# EAGLE design 601_motor (EAGLE 7.7.0)
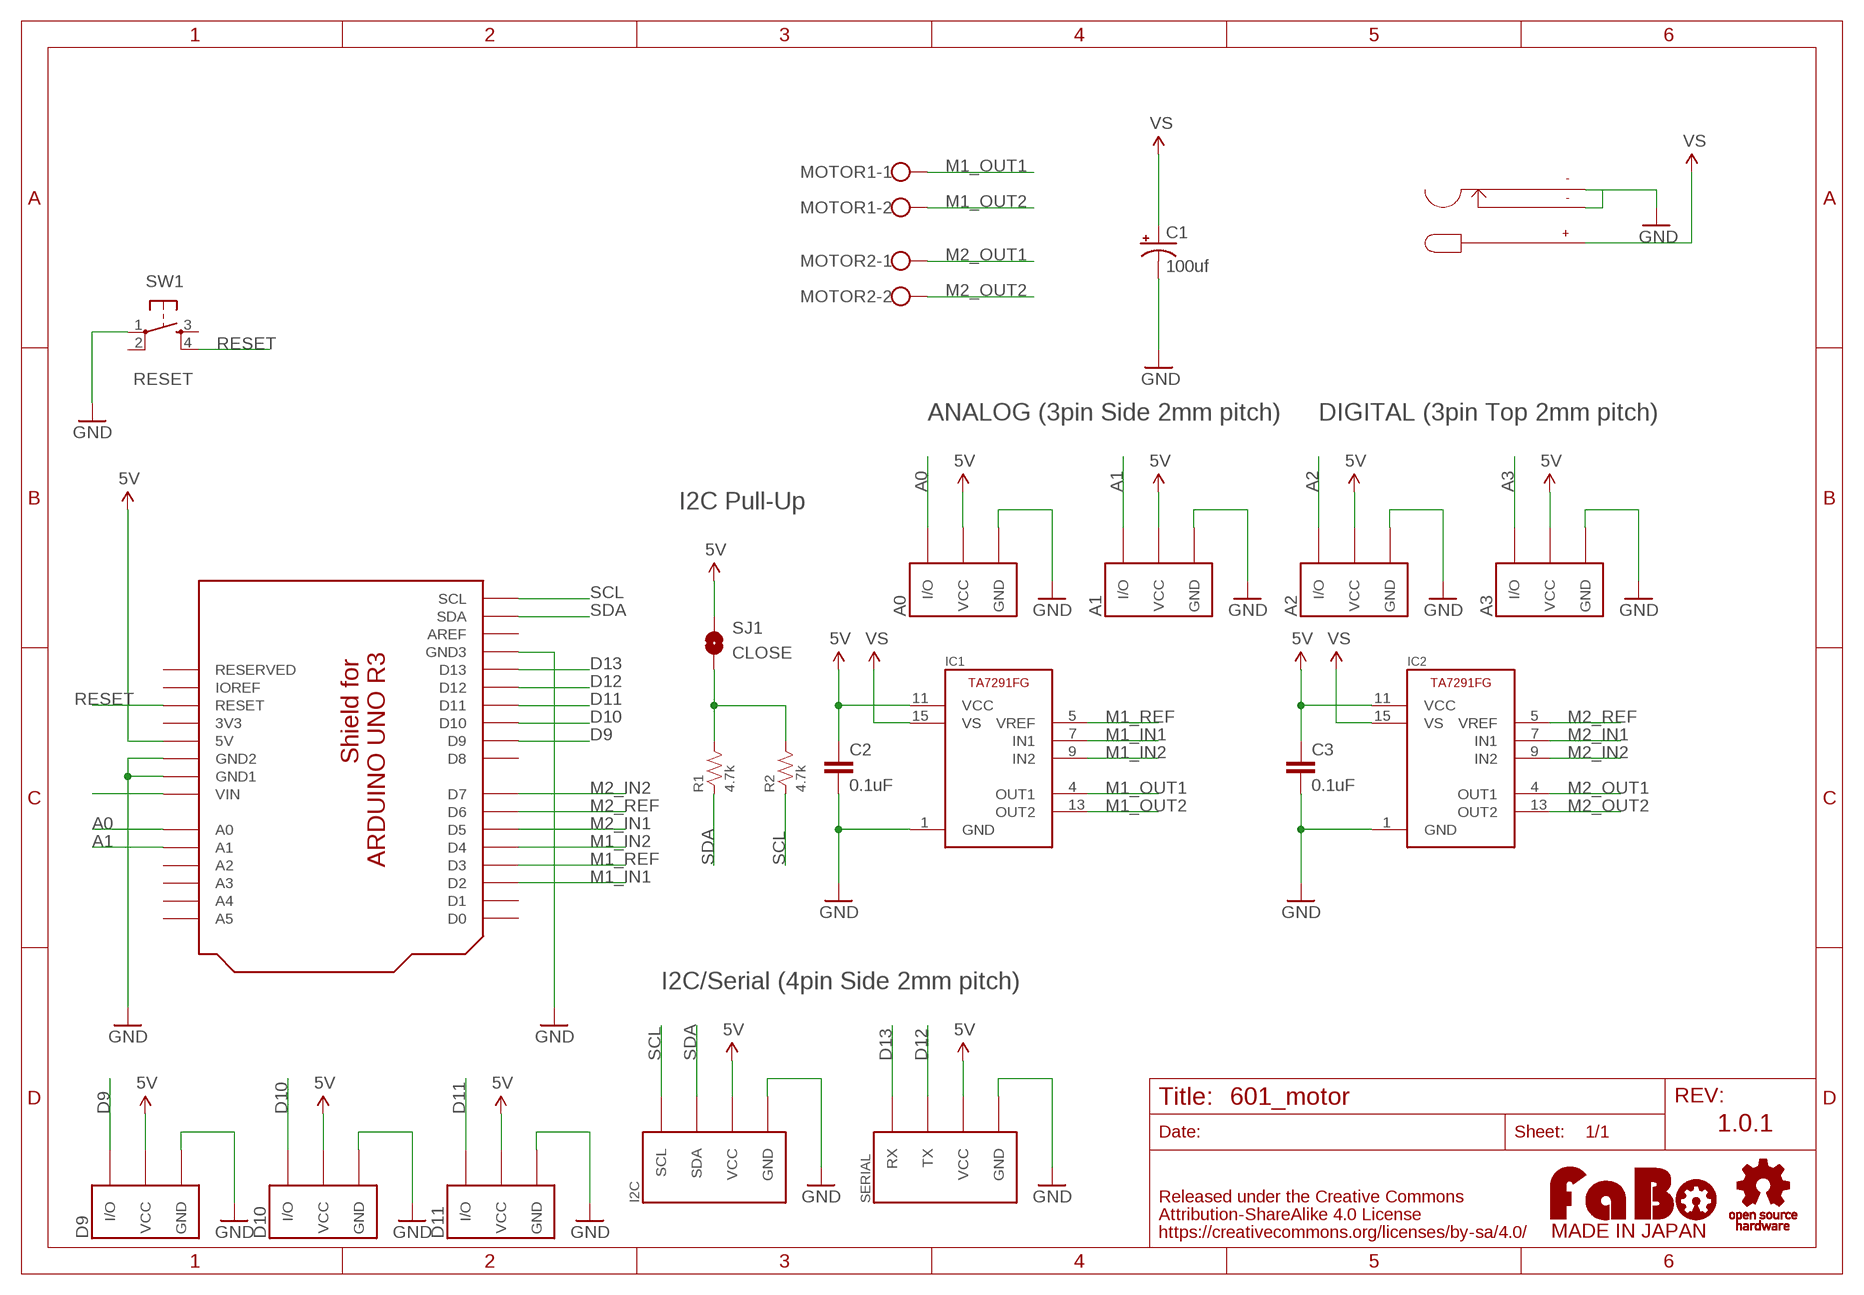
[diagram p0: schematic, sheet 1]

## Parts
A0  FABO_BRICK_3PIN-S03B-PASK-2  [FABO_BRICK_3PIN_S03B-PASK-2]
A1  FABO_BRICK_3PIN-S03B-PASK-2  [FABO_BRICK_3PIN_S03B-PASK-2]
A2  FABO_BRICK_3PIN-S03B-PASK-2  [FABO_BRICK_3PIN_S03B-PASK-2]
A3  FABO_BRICK_3PIN-S03B-PASK-2  [FABO_BRICK_3PIN_S03B-PASK-2]
C1  100uf  CPOL-US153CLV-0405  [153CLV-0405]
C2  0.1uF  CAP-EIA0603  [EIA0603]
C3  0.1uF  CAP-EIA0603  [EIA0603]
D9  FABO_BRICK_3PIN-HEADER  [FABO_BRICK_3PIN_HEADER]
D10  FABO_BRICK_3PIN-HEADER  [FABO_BRICK_3PIN_HEADER]
D11  FABO_BRICK_3PIN-HEADER  [FABO_BRICK_3PIN_HEADER]
I2C  FABO_BRICK_I2C-S04B-PASK-2  [FABO_BRICK_I2C_S04B-PASK-2]
IC1  MOTOR-DRIVER-TA7291FG  [MOTOR-DRIVER-TA7291FG]
IC2  MOTOR-DRIVER-TA7291FG  [MOTOR-DRIVER-TA7291FG]
MOTOR1  W237-102  [W237-102]
MOTOR2  W237-102  [W237-102]
R1  4.7k  RESISTOR-0603  [0603]
R2  4.7k  RESISTOR-0603  [0603]
SERIAL  FABO_BRICK_SERIAL-S04B-PASK-2  [FABO_BRICK_SERIAL_S04B-PASK-2]
SJ1  CLOSE  SMD-JUMPER-2-CLOSE  [SMD-JUMPER-2-CLOSE]
SW1  RESET  SWITCH-TACT-6MM  [DTS_6_V]
U1  ARDUINO_UNO_R3_SHIELD-NOLABEL  [ARDUINO_UNO_R3_NOLABEL]
U$2  DCJACK-MJ179PH  [MJ179PH]
U$6  LOGO_OSHW-T_M  [LOGO_OSHW_T_MS]
U$7  LOGO_FABO-M  [LOGO_FABO_MS]

## Nets
5V: A0.VCC A1.VCC A2.VCC A3.VCC C2.1 C3.1 D9.VCC D10.VCC D11.VCC I2C.VCC IC1.11(VCC) IC2.11(VCC) SERIAL.VCC SJ1.1 U1.5V
A0: A0.I/O U1.A0
A1: A1.I/O U1.A1
A2: A2.I/O
A3: A3.I/O
D9: D9.I/O U1.D9
D10: D10.I/O U1.D10
D11: D11.I/O U1.D11
D12: SERIAL.TX U1.D12
D13: SERIAL.RX U1.D13
GND: A0.GND A1.GND A2.GND A3.GND C1.- C2.2 C3.2 D9.GND D10.GND D11.GND I2C.GND IC1.1(GND) IC2.1(GND) SERIAL.GND SW1.1 U1.GND1 U1.GND2 U1.GND3 U$2.-@1(-) U$2.-@2(-)
M1_IN1: IC1.7(IN1) U1.D2
M1_IN2: IC1.9(IN2) U1.D4
M1_OUT1: IC1.4(OUT1) MOTOR1.1
M1_OUT2: IC1.13(OUT2) MOTOR1.2
M1_REF: IC1.5(VREF) U1.D3
M2_IN1: IC2.7(IN1) U1.D5
M2_IN2: IC2.9(IN2) U1.D7
M2_OUT1: IC2.4(OUT1) MOTOR2.1
M2_OUT2: IC2.13(OUT2) MOTOR2.2
M2_REF: IC2.5(VREF) U1.D6
N$1: R1.2 R2.2 SJ1.2
RESET: SW1.4 U1.RESET
SCL: I2C.SCL R2.1 U1.SCL
SDA: I2C.SDA R1.1 U1.SDA
VCC: U1.VIN
VS: C1.+ IC1.15(VS) IC2.15(VS) U$2.+
Unconnected: SW1.2 SW1.3 U1.A2 U1.A3 U1.A4 U1.A5 U1.AREF U1.D0 U1.D1 U1.D8 U1.IOREF U1.RESERVED

## Notes on the sheet
- ANALOG (3pin Side 2mm pitch) | DIGITAL (3pin Top 2mm pitch)
- I2C Pull-Up
- I2C/Serial (4pin Side 2mm pitch)
- 1.0.1

## Power pins joined to a net without a drawn wire
3V3: U1.3V3

## Library data of the parts
A0 A1-A3 D9-D11 = FaBo-Template:FABO_BRICK_3PIN: FaBo Brick 3pin
C1 = resistor:CPOL-US: POLARIZED CAPACITOR, American symbol
C2 C3 = FaBo-etc:CAP: Capacitor Standard 0603 ceramic capacitor
I2C = FaBo-Template:FABO_BRICK_I2C: FaBo Brick I2C
IC1 IC2 = FaBo-etc:MOTOR-DRIVER-TA7291FG
MOTOR1 MOTOR2 = con-wago-500:W237-102: WAGO SCREW CLAMP; MPN: 237-102; OC_FARNELL: unknown; OC_NEWARK: 70K9898
R1 R2 = FaBo-Resistors:RESISTOR: RESISTOR
SERIAL = FaBo-Template:FABO_BRICK_SERIAL: FaBo Brick Serial
SJ1 = FaBo-Supply:SMD-JUMPER-2
SW1 = FaBo-etc:SWITCH-TACT
U1 = FaBo-Boards:ARDUINO_UNO_R3_SHIELD
U$2 = FaBo-Supply:DCJACK-MJ179PH
U$6 = FaBo-etc:LOGO_OSHW
U$7 = FaBo-etc:LOGO_FABO

## Board
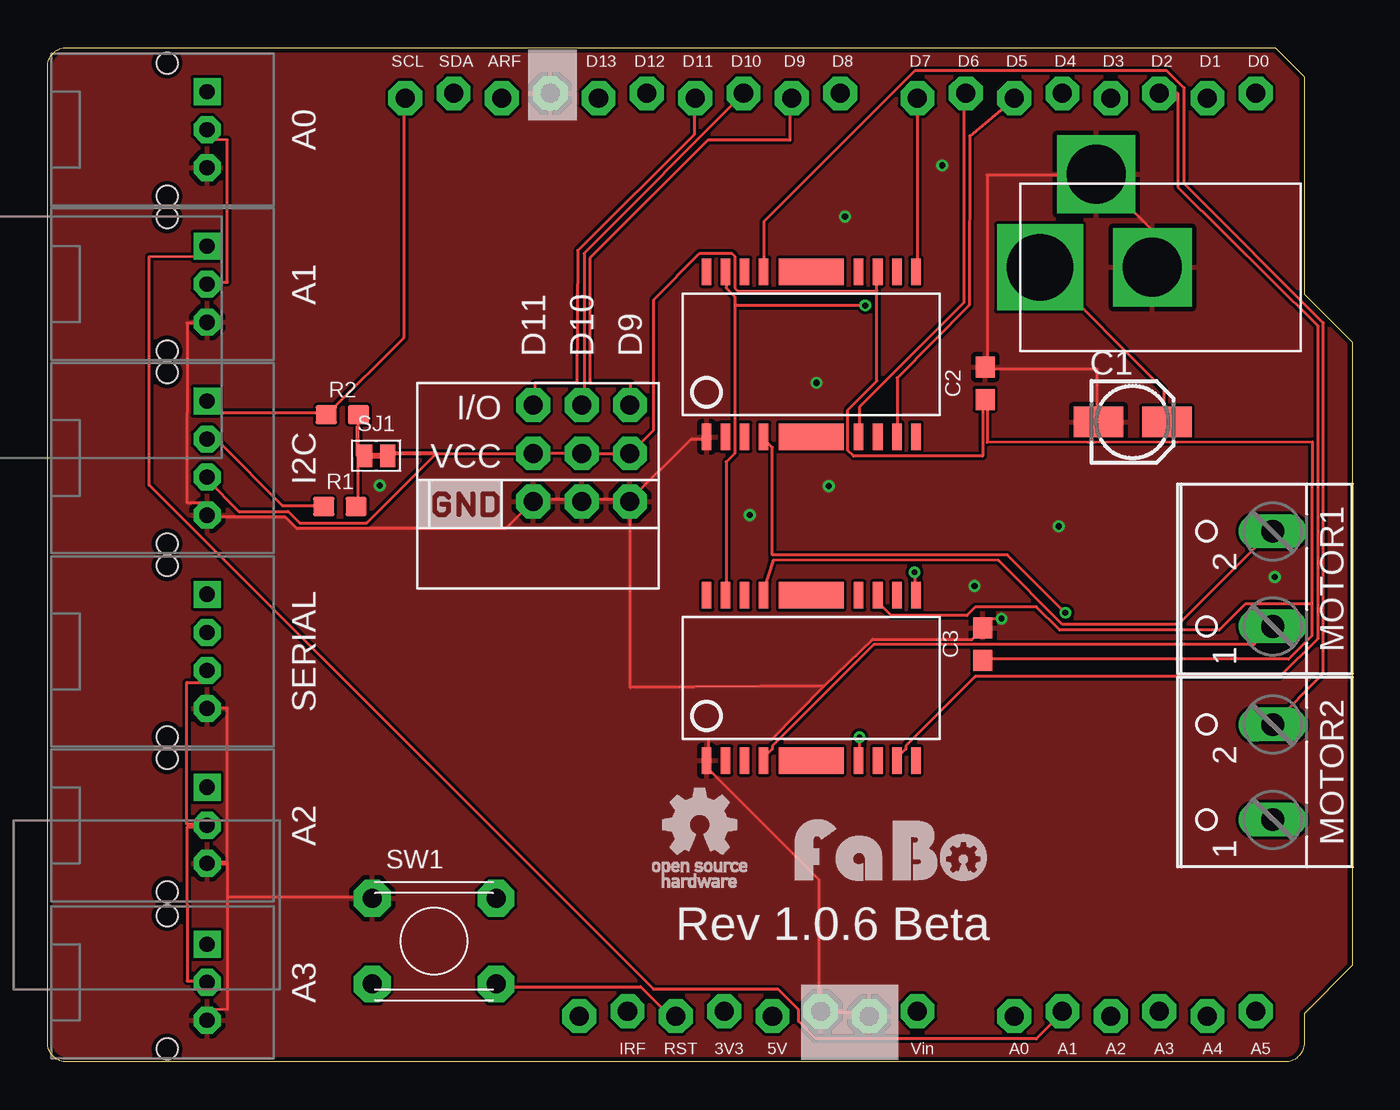
[diagram p1: board, top side]
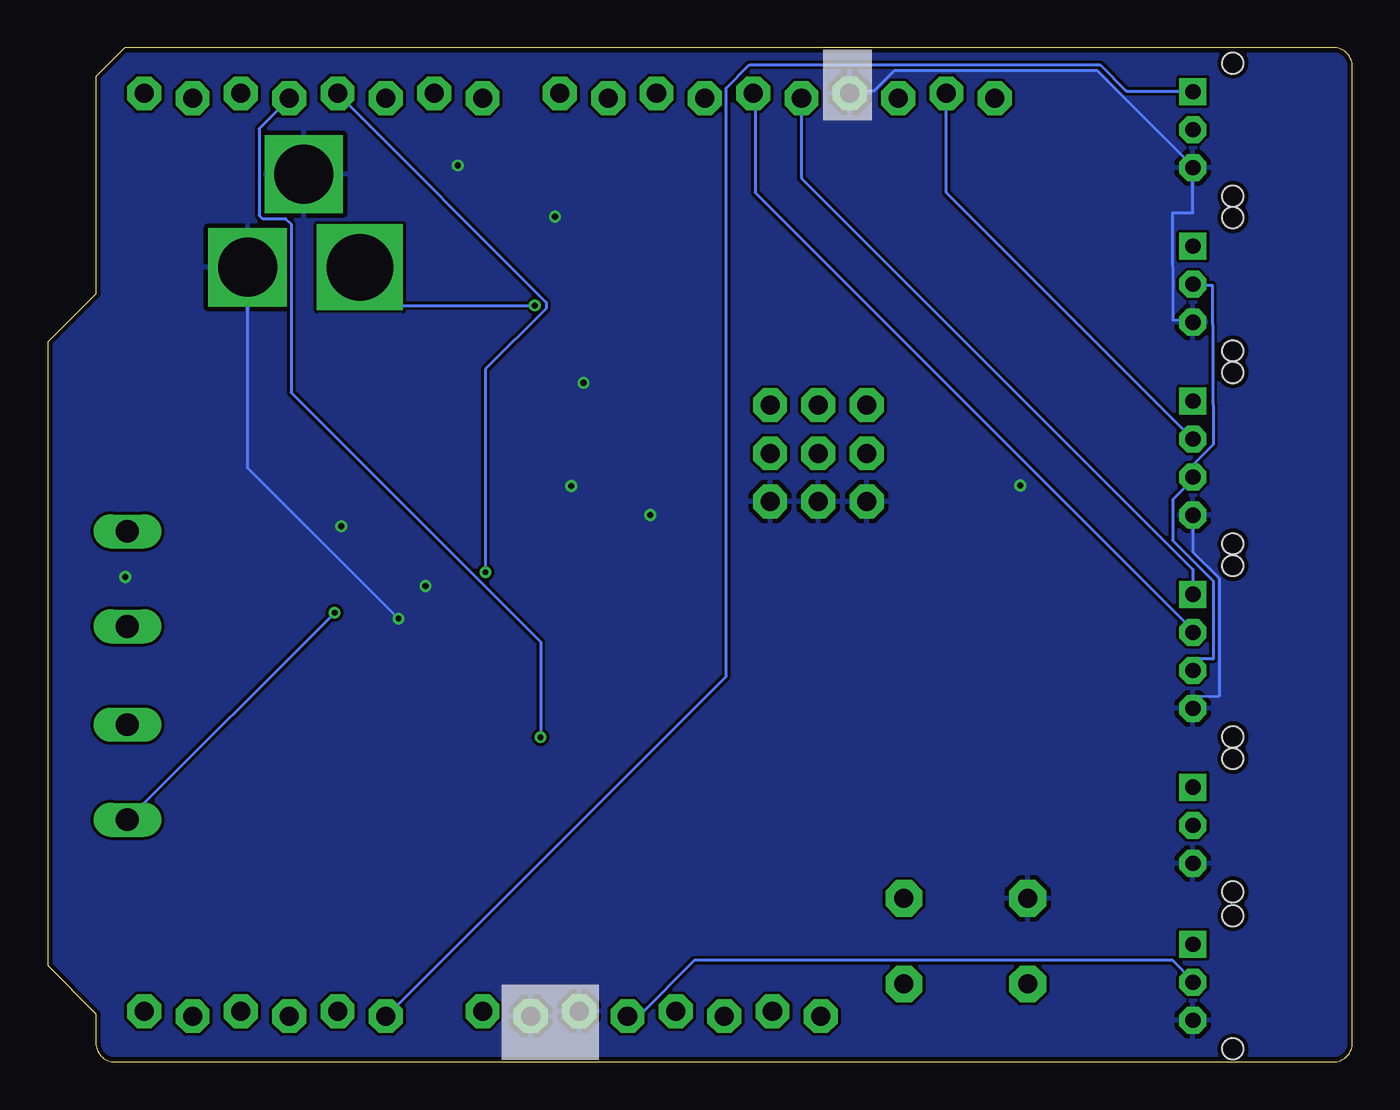
[diagram p2: board, bottom side, seen from below]

Size 68.58 x 53.34 mm. Coordinates in mm from the lower left corner, seen from the top.
Copper layers (1*16): Top 0.035mm / dielectric 1.5mm / Bottom 0.035mm
Design rules "SeeedStudio_2layer_DRU_no_angle_20140221": minimum track width 6mil, minimum drill 12mil, track to track 6mil, track to pad 6mil, pad to pad 6mil, via to via 6mil, smd to smd 0mil, copper to edge 10mil, drill to drill 10mil, minimum pad ring 10mil, minimum via ring 6mil, stop-mask expansion 2mil, vias tented up to drill 100mil, thermal gap 10mil

### Footprints (pad centres in the part's own frame; a part is rotated, then mirrored left to right if it is on the bottom)
FABO_BRICK_3PIN_S03B-PASK-2 = drill 0.8 pad 1.422 octagon: GND -2,0; VCC 0,0 | drill 0.8 pad 1.422 square: I/O 2,0 | hole 1.1: 3.5,2.1; -3.5,2.1
153CLV-0405 = smd 2.6 x 1.6: + 1.8,0; - -1.8,0
EIA0603 = smd 1.1 x 1: 1 -0.85,0; 2 0.85,0
FABO_BRICK_3PIN_HEADER = drill 1 pad 1.778 octagon: GND -2.54,0; I/O 2.54,0; VCC 0,0
FABO_BRICK_I2C_S04B-PASK-2 = drill 0.8 pad 1.422 octagon: GND -3,0; SDA 1,0; VCC -1,0 | drill 0.8 pad 1.422 square: SCL 3,0 | hole 1.1: 4.5,2.1; -4.5,2.1
MOTOR-DRIVER-TA7291FG = smd 0.5 x 1.4: 1 -5.5,-4.34; 2 -4.5,-4.34; 3 -3.5,-4.34; 4 -2.5,-4.34; 5 2.5,-4.34; 6 3.5,-4.34; 7 4.5,-4.34; 8 5.5,-4.34; 9 5.5,4.34; 10 4.5,4.34; 11 3.5,4.34; 12 2.5,4.34; 13 -2.5,4.34; 14 -3.5,4.34; 15 -4.5,4.34; 16 -5.5,4.34 | smd 3.4 x 1.4: 17 0,-4.34; 18 0,4.34
W237-102 = drill 1.194 long: 1 -2.5,-1.27; 2 2.5,-1.27
0603 = smd 1.1 x 1: 1 -0.85,0; 2 0.85,0
FABO_BRICK_SERIAL_S04B-PASK-2 = drill 0.8 pad 1.422 octagon: GND -3,0; TX 1,0; VCC -1,0 | drill 0.8 pad 1.422 square: RX 3,0 | hole 1.1: 4.5,2.1; -4.5,2.1
SMD-JUMPER-2-CLOSE = smd 0.8 x 1.2: 1 -0.6,0; 2 0.6,0
DTS_6_V = drill 1 pad 1.93 octagon: 1 -3.25,2.25; 2 3.25,2.25; 3 -3.25,-2.25; 4 3.25,-2.25
ARDUINO_UNO_R3_NOLABEL = drill 1 pad 1.778 octagon: 3V3 35.56,2.667; 5V 38.1,2.413; A0 50.8,2.413; A1 53.34,2.667; A2 55.88,2.413; A3 58.42,2.667; A4 60.96,2.413; A5 63.5,2.667; AREF 23.876,50.673; D0 63.5,50.927; D1 60.96,50.673; D2 58.42,50.927; D3 55.88,50.673; D4 53.34,50.927; D5 50.8,50.673; D6 48.26,50.927; D7 45.72,50.673; D8 41.656,50.927; D9 39.116,50.673; D10 36.576,50.927; D11 34.036,50.673; D12 31.496,50.927; D13 28.956,50.673; GND1 43.18,2.413; GND2 40.64,2.667; GND3 26.416,50.927; IOREF 30.48,2.667; RESERVED 27.94,2.413; RESET 33.02,2.413; SCL 18.796,50.673; SDA 21.336,50.927; VIN 45.72,2.667
MJ179PH = drill 3.5 square: + 2.95,0 | drill 3.1 square: -@1 -2.95,0; -@2 0,-4.9

### Placement (x,y rotation side)
A0  8.38,49.02 90 top
A1  8.38,40.89 90 top
A2  8.38,12.45 90 top
A3  8.38,4.19 90 top
C1  57.02,33.66 0 top
C2  49.28,35.69 90 top
C3  49.15,21.97 90 top
D9  30.61,32 90 top
D10  28.07,32 90 top
D11  25.53,32 90 top
I2C  8.38,31.75 90 top
IC1  40.13,20.19 0 top
IC2  40.13,37.21 0 top
MOTOR1  63.12,25.4 90 top
MOTOR2  63.12,15.24 90 top
R1  15.37,29.21 0 top
R2  15.49,34.04 0 top
SERIAL  8.38,21.59 90 top
SJ1  17.27,31.88 0 top
SW1  20.32,6.35 0 top
U1  0,0 0 top
U$2  55.12,41.78 180 top
U$6  34.29,12.45 0 top
U$7  44.32,9.14 0 top
U$19  [LOGO_SILK_GND]  20.07,28.07 0 top

### Tracks (layer width: path | path; a pad name or v marks a point on that pad's centre or on a via)
5V
  Top 0.152: A3.VCC 8.38,4.27 7.34,4.27 7.32,12.34 8.38,12.34 A2.VCC 8.38,12.5 7.32,12.5 7.32,19.96 8.38,19.96 SERIAL.VCC | 66.45,24.08 66.45,28.35 66.47,32.61 49.38,32.59 49.38,34.75 C2.1 49.23,34.75 49.15,34.75 49.15,31.85 42.37,31.85 42.06,32.16 42.06,34.29 43.59,35.81 43.59,40.54 | 66.45,24.08 66.45,22.4 65.23,21.18 49.23,21.18 C3.1 | 66.45,24.08 62.94,24.08 61.57,22.71 53.19,22.71 51.97,23.93 48.77,23.93 48.31,23.47 44.35,23.47 43.74,24.08 43.74,24.38 IC1.11 | 43.59,40.54 43.59,41.45 IC2.11 | A0.VCC 8.38,48.46 9.45,48.49 9.45,41 8.38,41 A1.VCC | I2C.VCC 8.38,30.63 10.06,28.96 12.65,28.96 13.26,28.35 16.76,28.35 20.42,32 D11.VCC D10.VCC D9.VCC 30.63,32 31.85,33.22 31.85,40.08 34.29,42.52 35.97,42.52 36.12,42.37 36.12,40.69 36.27,40.54 43.59,40.54
  Top 0.203: 20.42,32 17.87,32 17.87,31.88
  Bottom 0.152: U1.5V 38.1,2.44 37.49,2.44 34.59,5.33 9.45,5.33 8.38,4.27 A3.VCC | A1.VCC 8.38,40.84 7.37,40.84 7.32,32.46 8.38,31.39 I2C.VCC 8.38,30.63 9.45,29.57 9.45,27.43 7.32,25.3 7.32,21.18 8.38,21.18 SERIAL.VCC
A0
  Bottom 0.152: A0.I/O 8.38,51.05 11.89,51.05 13.26,52.43 31.7,52.43 32.92,51.21 32.92,20.27 50.75,2.44 U1.A0
A1
  Top 0.152: A1.I/O 8.38,42.37 5.33,42.34 5.33,30.33 31.85,3.81 38.41,3.81 39.47,2.74 39.47,2.13 40.39,1.22 51.97,1.22 53.34,2.59 U1.A1
D9
  Top 0.152: D9.I/O 30.63,34.59 30.63,35.69 28.5,35.69 28.5,42.27 34.7,48.46 39.01,48.46 39.01,50.6 U1.D9
D10
  Top 0.152: D10.I/O 28.19,34.59 28.19,42.52 36.58,50.9 U1.D10
D11
  Top 0.152: D11.I/O 25.6,34.59 25.6,35.69 27.81,35.69 27.86,42.67 33.98,48.77 33.98,50.6 U1.D11
D12
  Bottom 0.152: SERIAL.TX 8.38,22.71 31.39,45.72 31.39,50.9 U1.D12
D13
  Bottom 0.152: SERIAL.RX 8.38,25.91 28.96,46.48 U1.D13
GND  (via drill 0.3, 0.32)
  Top 0.152: A3.GND 8.38,2.74 9.45,2.77 9.45,8.69 | 9.45,8.69 9.45,10.44 8.38,10.36 A2.GND 8.38,10.52 9.45,10.52 9.45,18.59 SERIAL.GND | 9.45,8.69 17.07,8.69 SW1.1 | A1.GND 8.38,38.86 7.34,38.86 7.32,29.41 8.38,29.41 I2C.GND 8.38,28.65 12.5,28.65 13.11,28.04 24.08,28.04 25.45,29.41 D11.GND 25.6,29.57 28.04,29.57 D10.GND 28.19,29.57 30.48,29.57 D9.GND | C1.- 55.17,33.68 55.17,36.42 49.38,36.42 C2.2 49.38,36.58 49.38,46.63 55.02,46.63 U$2.-@2 55.17,46.63 58.06,43.74 58.06,41.91 U$2.-@1 | IC2.1 34.59,32.77 33.83,32.77 30.63,29.57 D9.GND | U1.GND1 43.13,2.44 42.98,2.59 40.69,2.59 U1.GND2 40.54,2.74 40.54,9.6 34.75,15.39 34.75,15.85 IC1.1 34.75,16 34.75,16.99 38.05,16.97 40.82,19.76 | 40.82,19.76 43.36,22.23 48.59,22.23 C3.2 49.23,22.86 49.68,23.32 v50.14,23.32 | 40.82,19.76 30.63,19.68 30.63,29.41 D9.GND
  Bottom 0.152: A1.GND 8.38,39.01 9.42,38.99 9.45,44.65 8.38,44.65 A0.GND 8.38,47.09 13.41,52.12 24.08,52.12 25.15,51.05 26.36,51.05 U1.GND3 | SERIAL.GND 8.38,19.2 7.01,19.23 7.01,25.45 8.38,26.82 I2C.GND | v50.14,23.32 58.06,31.24 58.06,41.76 U$2.-@1
  other vias: 41.91,44.45 47.02,47.14 40.41,35.71 41.05,30.28 36.91,28.75 53.14,28.17 48.72,25.02 64.49,25.5 17.45,30.3
  pour Bottom: 0,0 0,53.34 69.85,53.34 69.85,0
  pour Top: 0,0 0,53.34 69.85,53.34 69.85,0 68.58,0
M1_IN1
  Top 0.152: IC1.7 44.65,16 45.11,16.46 45.11,16.61 48.77,20.27 64.77,20.27 66.75,22.25 66.75,38.71 59.41,46 59.41,50.93 U1.D2
M1_IN2  (via drill 0.3)
  Top 0.152: v45.57,25.76 45.57,24.54 IC1.9
  Bottom 0.152: v45.57,25.76 45.57,36.42 42.37,39.62 42.37,39.93 53.34,50.9 U1.D4
M1_OUT1
  Top 0.152: IC1.4 37.64,16 38.1,16.46 38.1,16.61 43.43,21.95 63.4,21.95 64.31,22.86 MOTOR1.1
M1_OUT2
  Top 0.152: IC1.13 37.64,24.54 37.64,24.84 38.15,26.39 49.99,26.36 53.34,23.01 59.44,23.01 64.31,27.89 MOTOR1.2
M1_REF  (via drill 0.3)
  Top 0.152: v42.67,17.07 42.67,16 IC1.5
  Bottom 0.152: v42.67,17.07 42.67,22.1 55.78,35.2 55.78,44.04 56.08,44.35 57.3,44.35 57.45,44.5 57.45,49.07 55.93,50.6 U1.D3
M2_IN1
  Top 0.152: IC2.7 44.65,32.92 44.65,35.97 48.44,39.8 48.46,48.69 50.75,50.6 U1.D5
M2_IN2
  Top 0.152: U1.D7 45.72,41.6 IC2.9
M2_OUT1  (via drill 0.3)
  Top 0.152: v53.49,23.62 50.44,26.67 38.1,26.67 38.1,32.31 37.64,32.77 IC2.4
  Bottom 0.152: v53.49,23.62 64.31,12.8 MOTOR2.1
M2_OUT2
  Top 0.152: IC2.13 37.64,41.6 37.64,44.2 45.57,52.12 58.83,52.12 59.74,51.21 59.74,46.18 67.06,38.86 67.06,20.42 64.47,17.83 MOTOR2.2
M2_REF
  Top 0.152: IC2.5 42.67,32.92 42.67,34.44 48.16,39.93 48.16,50.9 U1.D6
N$1
  Top 0.152: R1.2 16.31,29.26 16.31,33.4 16.31,33.98 R2.2
  Top 0.203: 16.67,31.88 16.31,31.88 16.31,33.4
RESET
  Top 0.152: U1.RESET 32.92,2.44 32.49,2.64 31.17,3.96 23.62,3.96 SW1.4
SCL
  Top 0.152: I2C.SCL 8.99,34.14 14.63,34.14 R2.1 14.78,34.14 18.75,38.1 18.75,50.6 U1.SCL
SDA
  Top 0.152: R1.1 14.48,29.26 12.34,29.26 8.99,32.61 8.38,32.61 I2C.SDA
  Bottom 0.152: U1.SDA 21.34,45.72 8.38,32.77 I2C.SDA
VS  (via drill 0.3)
  Top 0.152: 36.12,39.78 36.12,40.23 35.66,40.69 35.66,41.45 IC2.15 | 36.12,39.78 36.12,32 35.66,31.55 35.66,24.54 IC1.15 | C1.+ 58.67,33.68 58.67,35.36 52.27,41.76 U$2.+ | v42.98,39.78 36.12,39.78
  Bottom 0.152: v42.98,39.78 50.14,39.78 52.12,41.76 U$2.+

### Text on the board
tPlace: SCL | SDA | ARF | D13 | D12 | D11 | D10 | D9 | D8 | D7 | D6 | D5 | D4 | D3 | D2 | D1 | D0 | I/O | VCC | Rev 1.0.6 Beta | IRF | RST | 3V3 | 5V | Vin | A0 | A1 | A2 | A3 | A4 | A5